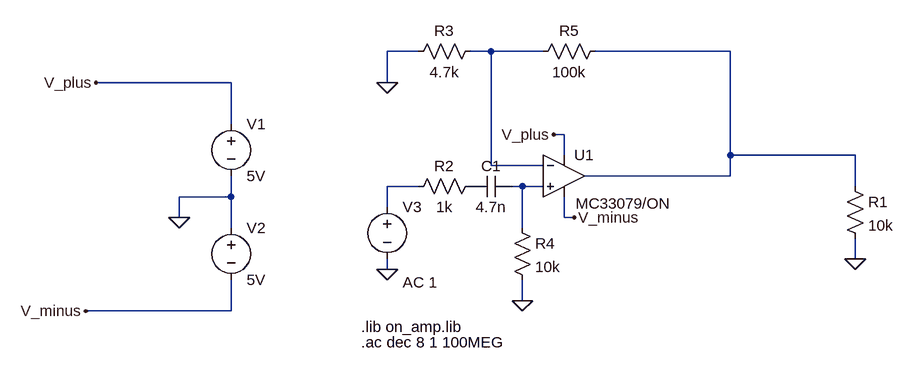
[diagram p0: schematic closedloop_gain_noninverting.asc]
closedloop_gain_noninverting.asc, the LTspice schematic file:
Version 4
SHEET 1 920 840
WIRE -752 -48 -800 -48
WIRE -640 -48 -672 -48
WIRE -560 -48 -640 -48
WIRE -272 -48 -480 -48
WIRE -1040 0 -1248 0
WIRE -800 0 -800 -48
WIRE -1040 64 -1040 0
WIRE -528 80 -544 80
WIRE -528 112 -528 80
WIRE -272 112 -272 -48
WIRE -80 112 -272 112
WIRE -640 128 -640 -48
WIRE -560 128 -640 128
WIRE -272 144 -272 112
WIRE -272 144 -496 144
WIRE -752 160 -800 160
WIRE -592 160 -608 160
WIRE -560 160 -592 160
WIRE -80 160 -80 112
WIRE -1040 176 -1040 144
WIRE -1040 176 -1120 176
WIRE -800 192 -800 160
WIRE -1120 208 -1120 176
WIRE -528 208 -528 176
WIRE -512 208 -528 208
WIRE -1040 224 -1040 176
WIRE -592 224 -592 160
WIRE -80 272 -80 240
WIRE -800 288 -800 272
WIRE -592 336 -592 304
WIRE -1040 352 -1040 304
WIRE -1040 352 -1264 352
FLAG -1120 208 0
FLAG -1248 0 V_plus
FLAG -1264 352 V_minus
FLAG -512 208 V_minus
FLAG -544 80 V_plus
FLAG -800 288 0
FLAG -800 0 0
FLAG -80 272 0
FLAG -592 336 0
SYMBOL Opamps\\opamp2 -528 80 R0
WINDOW 3 18 106 Left 0
SYMATTR InstName U1
SYMATTR Value MC33079/ON
SYMBOL voltage -1040 48 R0
WINDOW 123 0 0 Left 0
WINDOW 39 0 0 Left 0
SYMATTR InstName V1
SYMATTR Value 5V
SYMBOL voltage -1040 208 R0
WINDOW 123 0 0 Left 0
WINDOW 39 0 0 Left 0
SYMATTR InstName V2
SYMATTR Value 5V
SYMBOL voltage -800 176 R0
WINDOW 123 24 132 Left 0
WINDOW 39 0 0 Left 0
SYMATTR Value2 AC 1
SYMATTR InstName V3
SYMATTR Value ""
SYMBOL res -656 144 R90
WINDOW 0 0 56 VBottom 0
WINDOW 3 32 56 VTop 0
SYMATTR InstName R2
SYMATTR Value 1k
SYMBOL cap -608 144 R90
WINDOW 0 0 32 VBottom 0
WINDOW 3 32 32 VTop 0
SYMATTR InstName C1
SYMATTR Value 4.7n
SYMBOL res -656 -64 R90
WINDOW 0 0 56 VBottom 0
WINDOW 3 32 56 VTop 0
SYMATTR InstName R3
SYMATTR Value 4.7k
SYMBOL res -464 -64 R90
WINDOW 0 0 56 VBottom 0
WINDOW 3 32 56 VTop 0
SYMATTR InstName R5
SYMATTR Value 100k
SYMBOL res -96 144 R0
SYMATTR InstName R1
SYMATTR Value 10k
SYMBOL res -608 208 R0
SYMATTR InstName R4
SYMATTR Value 10k
TEXT -840 376 Left 0 !.lib on_amp.lib
TEXT -840 400 Left 0 !.ac dec 8 1 100MEG

The netlist it stands for:
* closedloop_gain_noninverting.asc
XU1 N004 N001 V_plus V_minus N002 MC33079/ON  ; pins In+ In- V+ V- OUT
V1 V_plus 0 5V
V2 0 V_minus 5V
V3 N003 0 AC 1
R2 P001 N003 1k
C1 N004 P001 4.7n
R3 N001 0 4.7k
R5 N002 N001 100k
R1 N002 0 10k
R4 N004 0 10k
.lib on_amp.lib
.ac dec 8 1 100MEG
.backanno
.end